# Altium project AMS_Remote_Module.PrjPcb
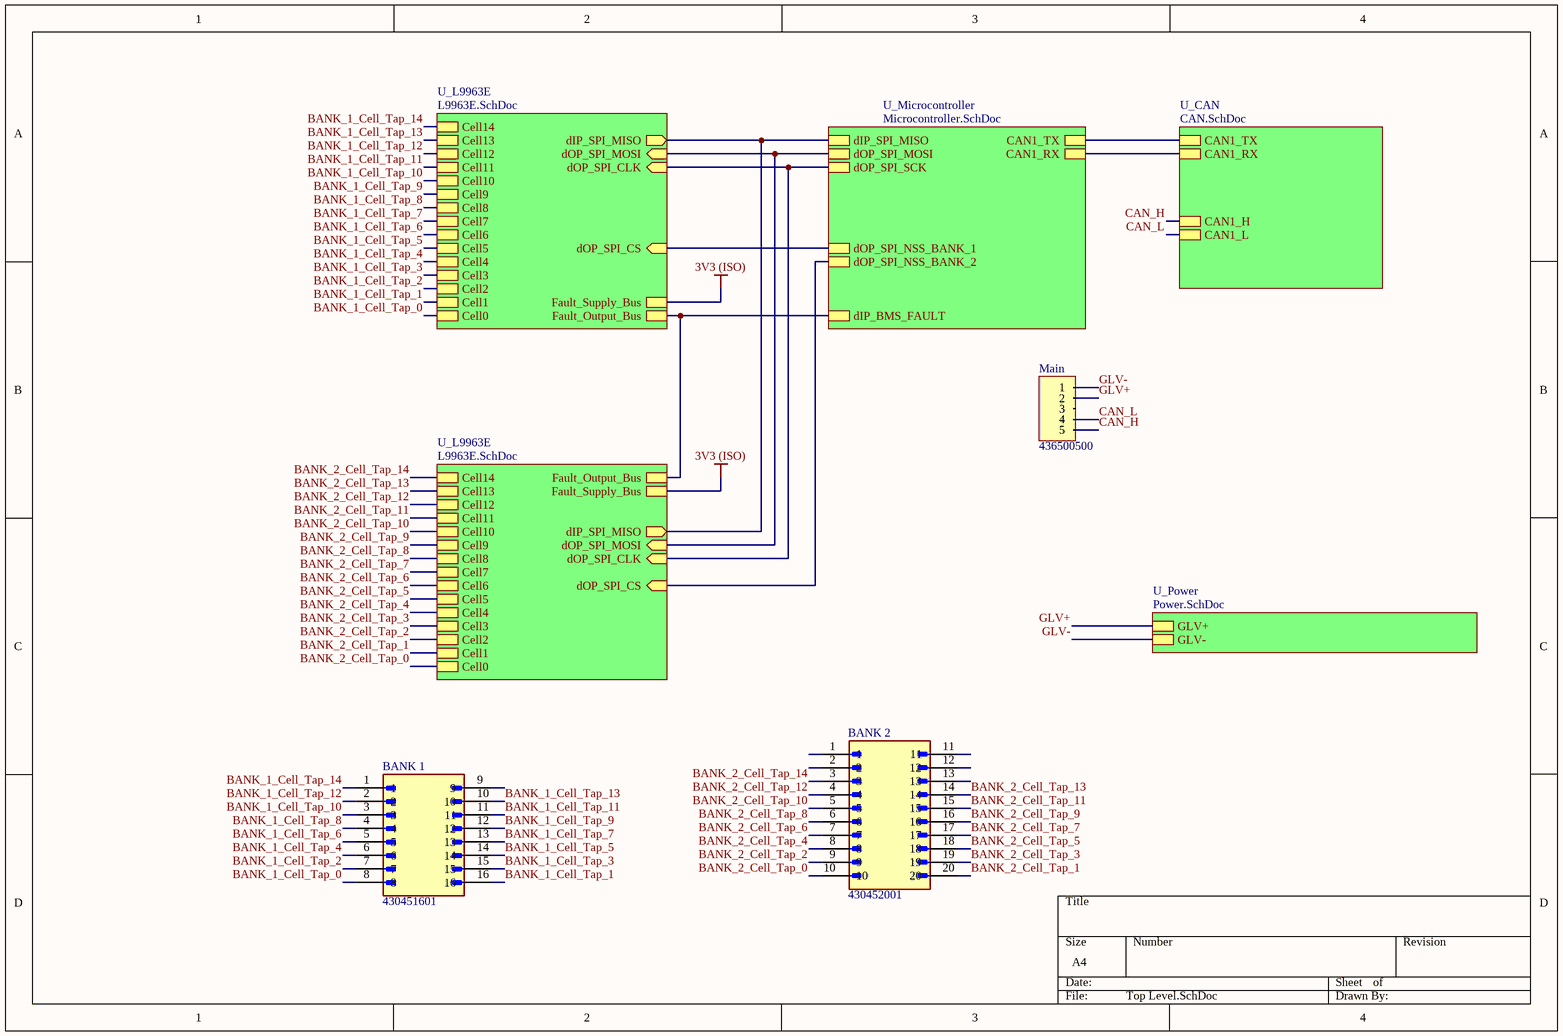
[diagram p0: Top Level.SchDoc]
5 sheets, 282 parts. Net scope: hierarchical (ports join the sheet entries above them; power ports are global).
Board file: AMS_Remote_Module_A1.PcbDoc
Sheets:
  Top Level.SchDoc
    U_Microcontroller = Microcontroller.SchDoc
    U_L9963E = L9963E.SchDoc
    U_CAN = CAN.SchDoc
    U_L9963E = L9963E.SchDoc
    U_Power = Power.SchDoc

## Sheet Top Level.SchDoc
size A4; SheetNumber: 1; SheetTotal: 5

### Parts
BANK_1  430451601  [430451601]
BANK_2  430452001  [430452001]
Main  436500500  [436500500]

### Sub-sheets
U_CAN = CAN.SchDoc: CAN1_H, CAN1_L, CAN1_TX, CAN1_RX
U_L9963E = L9963E.SchDoc: Cell14, Cell13, Cell12, Cell11, Cell10, Cell9, Cell8, Cell7, Cell6, Cell5, Cell4, Cell3, Cell2, Cell1, Cell0, dOP_SPI_CS (in), dOP_SPI_CLK (in), dOP_SPI_MOSI (in), dIP_SPI_MISO (out), Fault_Supply_Bus, Fault_Output_Bus
U_L9963E = L9963E.SchDoc: Cell14, Cell13, Cell12, Cell11, Cell10, Cell9, Cell8, Cell7, Cell6, Cell5, Cell4, Cell3, Cell2, Cell1, Cell0, dOP_SPI_CS (in), dOP_SPI_CLK (in), dOP_SPI_MOSI (in), dIP_SPI_MISO (out), Fault_Supply_Bus, Fault_Output_Bus
U_Microcontroller = Microcontroller.SchDoc: CAN1_RX, CAN1_TX, dIP_SPI_MISO, dOP_SPI_MOSI, dOP_SPI_SCK, dOP_SPI_NSS_BANK_1, dOP_SPI_NSS_BANK_2, dIP_BMS_FAULT
U_Power = Power.SchDoc: GLV+, GLV-

### Nets
3V3 (ISO): sheet U_L9963E/Fault_Supply_Bus, sheet U_L9963E/Fault_Supply_Bus
BANK_1_Cell_Tap_0: BANK_1.8 ; sheet U_L9963E/Cell0
BANK_1_Cell_Tap_1: BANK_1.16 ; sheet U_L9963E/Cell1
BANK_1_Cell_Tap_2: BANK_1.7 ; sheet U_L9963E/Cell2
BANK_1_Cell_Tap_3: BANK_1.15 ; sheet U_L9963E/Cell3
BANK_1_Cell_Tap_4: BANK_1.6 ; sheet U_L9963E/Cell4
BANK_1_Cell_Tap_5: BANK_1.14 ; sheet U_L9963E/Cell5
BANK_1_Cell_Tap_6: BANK_1.5 ; sheet U_L9963E/Cell6
BANK_1_Cell_Tap_7: BANK_1.13 ; sheet U_L9963E/Cell7
BANK_1_Cell_Tap_8: BANK_1.4 ; sheet U_L9963E/Cell8
BANK_1_Cell_Tap_9: BANK_1.12 ; sheet U_L9963E/Cell9
BANK_1_Cell_Tap_10: BANK_1.3 ; sheet U_L9963E/Cell10
BANK_1_Cell_Tap_11: BANK_1.11 ; sheet U_L9963E/Cell11
BANK_1_Cell_Tap_12: BANK_1.2 ; sheet U_L9963E/Cell12
BANK_1_Cell_Tap_13: BANK_1.10 ; sheet U_L9963E/Cell13
BANK_1_Cell_Tap_14: BANK_1.1 ; sheet U_L9963E/Cell14
BANK_2_Cell_Tap_0: BANK_2.10 ; sheet U_L9963E/Cell0
BANK_2_Cell_Tap_1: BANK_2.20 ; sheet U_L9963E/Cell1
BANK_2_Cell_Tap_2: BANK_2.9 ; sheet U_L9963E/Cell2
BANK_2_Cell_Tap_3: BANK_2.19 ; sheet U_L9963E/Cell3
BANK_2_Cell_Tap_4: BANK_2.8 ; sheet U_L9963E/Cell4
BANK_2_Cell_Tap_5: BANK_2.18 ; sheet U_L9963E/Cell5
BANK_2_Cell_Tap_6: BANK_2.7 ; sheet U_L9963E/Cell6
BANK_2_Cell_Tap_7: BANK_2.17 ; sheet U_L9963E/Cell7
BANK_2_Cell_Tap_8: BANK_2.6 ; sheet U_L9963E/Cell8
BANK_2_Cell_Tap_9: BANK_2.16 ; sheet U_L9963E/Cell9
BANK_2_Cell_Tap_10: BANK_2.5 ; sheet U_L9963E/Cell10
BANK_2_Cell_Tap_11: BANK_2.15 ; sheet U_L9963E/Cell11
BANK_2_Cell_Tap_12: BANK_2.4 ; sheet U_L9963E/Cell12
BANK_2_Cell_Tap_13: BANK_2.14 ; sheet U_L9963E/Cell13
BANK_2_Cell_Tap_14: BANK_2.3 ; sheet U_L9963E/Cell14
CAN1_RX: sheet U_Microcontroller/CAN1_RX, sheet U_CAN/CAN1_RX
CAN1_TX: sheet U_Microcontroller/CAN1_TX, sheet U_CAN/CAN1_TX
CAN_H: Main.5 ; sheet U_CAN/CAN1_H
CAN_L: Main.4 ; sheet U_CAN/CAN1_L
GLV+: Main.2 ; sheet U_Power/GLV+
GLV-: Main.1 ; sheet U_Power/GLV-
SPI1_MISO: sheet U_Microcontroller/dIP_SPI_MISO, sheet U_L9963E/dIP_SPI_MISO, sheet U_L9963E/dIP_SPI_MISO
SPI1_MOSI: sheet U_Microcontroller/dOP_SPI_MOSI, sheet U_L9963E/dOP_SPI_MOSI, sheet U_L9963E/dOP_SPI_MOSI
SPI1_NSS_BANK_1: sheet U_Microcontroller/dOP_SPI_NSS_BANK_1, sheet U_L9963E/dOP_SPI_CS
SPI1_NSS_BANK_2: sheet U_Microcontroller/dOP_SPI_NSS_BANK_2, sheet U_L9963E/dOP_SPI_CS
SPI1_SCK: sheet U_Microcontroller/dOP_SPI_SCK, sheet U_L9963E/dOP_SPI_CLK, sheet U_L9963E/dOP_SPI_CLK
NetR3_2: sheet U_Microcontroller/dIP_BMS_FAULT, sheet U_L9963E/Fault_Output_Bus, sheet U_L9963E/Fault_Output_Bus

Not connected (* = marked no-connect by the designer): BANK_1 9; BANK_2 1 2 11 12 13; Main 3

### Library data of the parts
BANK_1 = 430451601: Micro-Fit 8x2 TH R/A; Positions: 16; Pitch: 3.0mm; Angle: 90; Flange: No; Contact: Gold; Price: None; Availability: Unavailable; Package: None; MP: 430451601; Value: *; Part Number: 430451601; Row Spacing: 3.0mm; Digikey Part Number: WM7490-ND; Digikey Link: https://www.digikey.com.au/en/products/detail/molex/0430451601/3044582
BANK_2 = 430452001: Micro-Fit 10x2 TH R/A; Positions: 20; Pitch: 3.0mm; Angle: 90; Flange: No; Contact: Gold; MP: 430452001; Package: None; Price: None; Availability: Unavailable; Value: *; Part Number: 430452001; Row Spacing: 3.0mm; Digikey Part Number: WM7492-ND; Digikey Link: https://www.digikey.com.au/en/products/detail/molex/0430452001/3044584
Main = 436500500: Micro-Fit 5x1; Positions: 5; Pitch: 3.0mm; Angle: 90; Flange: No; Contact: Tin; Part Number: 436500500; Row Spacing: 3.0mm; Digikey Part Number: WM1863-ND; Digikey Link: https://www.digikey.com.au/en/products/detail/molex/0436500500/268992

## Sheet Microcontroller.SchDoc
size A4; SheetNumber: 2; SheetTotal: 5
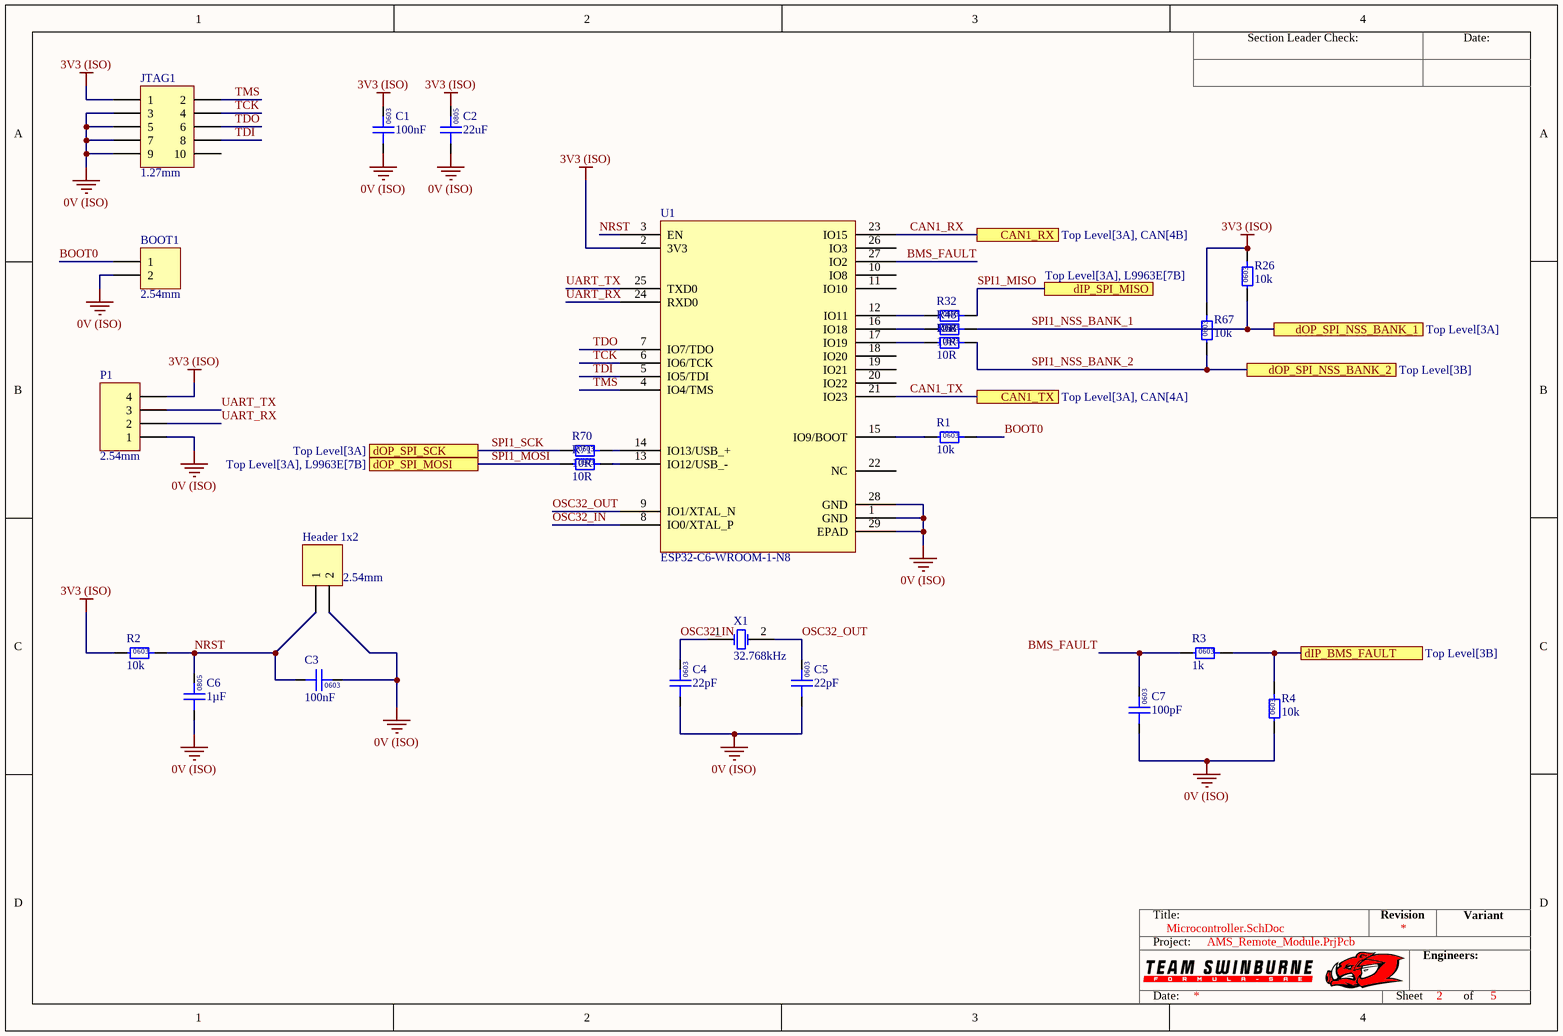
[diagram p1: Microcontroller.SchDoc]

### Parts
BOOT1  2.54mm  [TH 2.54mm Header 1x2]
C1  100nF  [0603]
C2  22uF  [0805]
C3  100nF  [0603]
C4  22pF  [0603]
C5  22pF  [0603]
C6  1µF  [0805]
C7  100pF  [0603]
Header_1x2  2.54mm  [TH 2.54mm Header 1x2]
JTAG1  1.27mm  [3221-10-0300-00]
P1  2.54mm  [TH 2.54mm Header 1x4]
R1  10k  [0603]
R2  10k  [0603]
R3  1k  [0603]
R4  10k  [0603]
R26  10k  [0603]
R32  10R  [0603]
R48  10R  [0603]
R67  10k  [0603]
R68  10R  [0603]
R70  10R  [0603]
R71  10R  [0603]
U1  ESP32-C6-WROOM-1-N8  [ESP32-C6-WROOM-1-N8]
X1  32.768kHz  [EPSON 2-SMD]

### Ports
CAN1_RX (see Top Level[3A], CAN[4B]), CAN1_TX (see Top Level[3A], CAN[4A]), dIP_BMS_FAULT (see Top Level[3B]), dIP_SPI_MISO (see Top Level[3A], L9963E[7B]), dOP_SPI_MOSI (see Top Level[3A], L9963E[7B]), dOP_SPI_NSS_BANK_1 (see Top Level[3A]), dOP_SPI_NSS_BANK_2 (see Top Level[3B]), dOP_SPI_SCK (see Top Level[3A])

### Nets
0V (ISO): BOOT1.2 C1.1 C2.1 C3.2 C4.1 C5.1 C6.1 C7.1 Header_1x2.2 JTAG1.3 JTAG1.5 JTAG1.7 JTAG1.9 P1.1 R4.1 U1.1(GND) U1.28(GND) U1.29(EPAD)
3V3 (ISO): C1.2 C2.2 JTAG1.1 P1.4 R2.1 R26.2 R67.2 U1.2(3V3)
BMS_FAULT: C7.2 R3.1 U1.27(IO2)
BOOT0: BOOT1.1 R1.2
CAN1_RX: U1.23(IO15) ; port CAN1_RX
CAN1_TX: U1.21(IO23) ; port CAN1_TX
NRST: C3.1 C6.2 Header_1x2.1 R2.2 U1.3(EN)
OSC32_IN: C4.2 U1.8(IO0/XTAL_P) X1.1(OSC1)
OSC32_OUT: C5.2 U1.9(IO1/XTAL_N) X1.2(OSC2)
SPI1_MISO: R32.2 ; port dIP_SPI_MISO
SPI1_MOSI: R71.1 ; port dOP_SPI_MOSI
SPI1_NSS_BANK_1: R26.1 R48.2 ; port dOP_SPI_NSS_BANK_1
SPI1_NSS_BANK_2: R67.1 R68.2 ; port dOP_SPI_NSS_BANK_2
SPI1_SCK: R70.1 ; port dOP_SPI_SCK
TCK: JTAG1.4 U1.6(IO6/TCK)
TDI: JTAG1.8 U1.5(IO5/TDI)
TDO: JTAG1.6 U1.7(IO7/TDO)
TMS: JTAG1.2 U1.4(IO4/TMS)
UART_RX: P1.2 U1.24(RXD0)
UART_TX: P1.3 U1.25(TXD0)
NetR1_1: R1.1 U1.15(IO9/BOOT)
NetR3_2: R3.2 R4.2 ; port dIP_BMS_FAULT
NetR32_1: R32.1 U1.12(IO11)
NetR48_1: R48.1 U1.16(IO18)
NetR68_1: R68.1 U1.17(IO19)
NetR70_2: R70.2 U1.14(IO13/USB_+)
NetR71_2: R71.2 U1.13(IO12/USB_-)

Not connected (* = marked no-connect by the designer): JTAG1 10; U1 10(IO8) 11(IO10) 18(IO20) 19(IO21) 20(IO22) 22(NC) 26(IO3)

### Notes on the sheet
- Section Leader Check:
- Date:
- Title:
- Revision
- Variant
- Project:
- Engineers:
- Sheet
- of
- (in symbol GCM21BR71H105KA03L) 0805
- (in symbol GCM188L81H104KA57D) 0603
- (in symbol GRM21BR61A226ME51L) 0805
- (in symbol GRM0335C1H220JA01D) 0603
- (in symbol GRM1885C1H101JA01D) 0603
- (in symbol RC0603FR-071KL) 0603
- (in symbol RC0603FR-0710KL) 0603
- (in symbol RC0603FR-0710RL) 0603

### Library data of the parts
BOOT1 Header_1x2 = TH 2.54mm Header 1x2: Positions: 2; Angle: 0; Flange: No; Contact: NA; Part Number: TH 2.54mm Header 1x2; Pitch: 2.54mm; Row Spacing: 2.54mm
C1 C3 = GCM188L81H104KA57D: Manufacturer: muRata; Rated Voltage: 50V; Tolerance: ±10%; Material: MLCC; Temperature Rating: X8L; Part Number: GCM188L81H104KA57D; Value: 100nF; Digikey Part Number: 490-6049-1-ND
C2 = GRM21BR61A226ME51L: Manufacturer: muRata; Rated Voltage: 50V; Tolerance: 20%; Material: MLCC; Temperature Rating: X5R; Part Number: GRM21BR61A226ME51L; Value: 22uF; Digikey Part Number: 490-10511-1-ND
C4 C5 = GRM0335C1H220JA01D: Manufacturer: Murata Electronics; Rated Voltage: 50V; Tolerance: ±5%; Material: MLCC; Temperature Rating: C0G, NP0; Part Number: GRM0335C1H220JA01D; Value: 22pF; Digikey Part Number: 490-6123-1-ND
C6 = GCM21BR71H105KA03L: Manufacturer: muRata; Rated Voltage: 50V; Tolerance: ±10%; Material: MLCC; Temperature Rating: X7R; Part Number: GCM21BR71H105KA03L; Value: 1µF; Digikey Part Number: 490-10675-1-ND
C7 = GRM1885C1H101JA01D: Manufacturer: Murata Electronics; Rated Voltage: 50V; Tolerance: ±5%; Material: MLCC; Temperature Rating: C0G, NP0; Part Number: GRM1885C1H101JA01D; Value: 100pF; Digikey Part Number: 490-1427-1-ND
JTAG1 = SMD 1.27mm Header 2x5 (3221-10-0300-00): Positions: 10; Angle: 0; Flange: No; Contact: NA; Part Number: SMD 1.27mm Header 2x5 (3221-10-0300-00); Pitch: 1.27mm; Row Spacing: 1.27mm
P1 = TH 2.54mm Header 1x4: Positions: 4; Angle: 0; Flange: No; Contact: NA; Part Number: TH 2.54mm Header 1x4; Pitch: 2.54mm; Row Spacing: 2.54mm
R1 R2 R4 R26 R67 = RC0603FR-0710KL: Manufacturer: YAGEO; Tolerance: 0.01; Rated Power: 0.1W; Part Number: RC0603FR-0710KL; Value: 10k; Material: FR-07; Digikey Part Number: 311-10.0KHRCT-ND
R3 = RC0603FR-071KL: Manufacturer: YAGEO; Tolerance: 0.01; Rated Power: 0.1W; Part Number: RC0603FR-071KL; Value: 1k; Material: FR-07; Digikey Part Number: 311-1.00KHRCT-ND
R32 R48 R68 R70 R71 = RC0603FR-0710RL: Manufacturer: YAGEO; Tolerance: 0.01; Rated Power: 0.1W; Part Number: RC0603FR-0710RL; Value: 10R; Material: FR-07; Digikey Part Number: 311-10.0HRCT-ND
U1 = ESP32-C6-WROOM-1-N8: RF TXRX MOD BT WIFI PCB TH SMD; Manufacturer: Espressif; Complex IC: 1; Part Number: ESP32-C6-WROOM-1-N8
X1 = FC-135 32.7680KA-A5: Manufacturer: EPSON; Load Capacitance: 12.5pF; ESR: 70k; Part Number: FC-135 32.7680KA-A5; Value: 32.768kHz; Digikey Part Number: SER4103TR-ND; Digikey Link: https://www.digikey.com/product-detail/en/epson/FC-135-32.7680KA-A5/SER4103TR-ND/5259895

## Sheet L9963E.SchDoc
size A3; SheetNumber: 3; SheetTotal: 5
Used 2 times, as channels U_L9963E, U_L9963E. Parts and nets are listed once, with the designators drawn on the sheet.
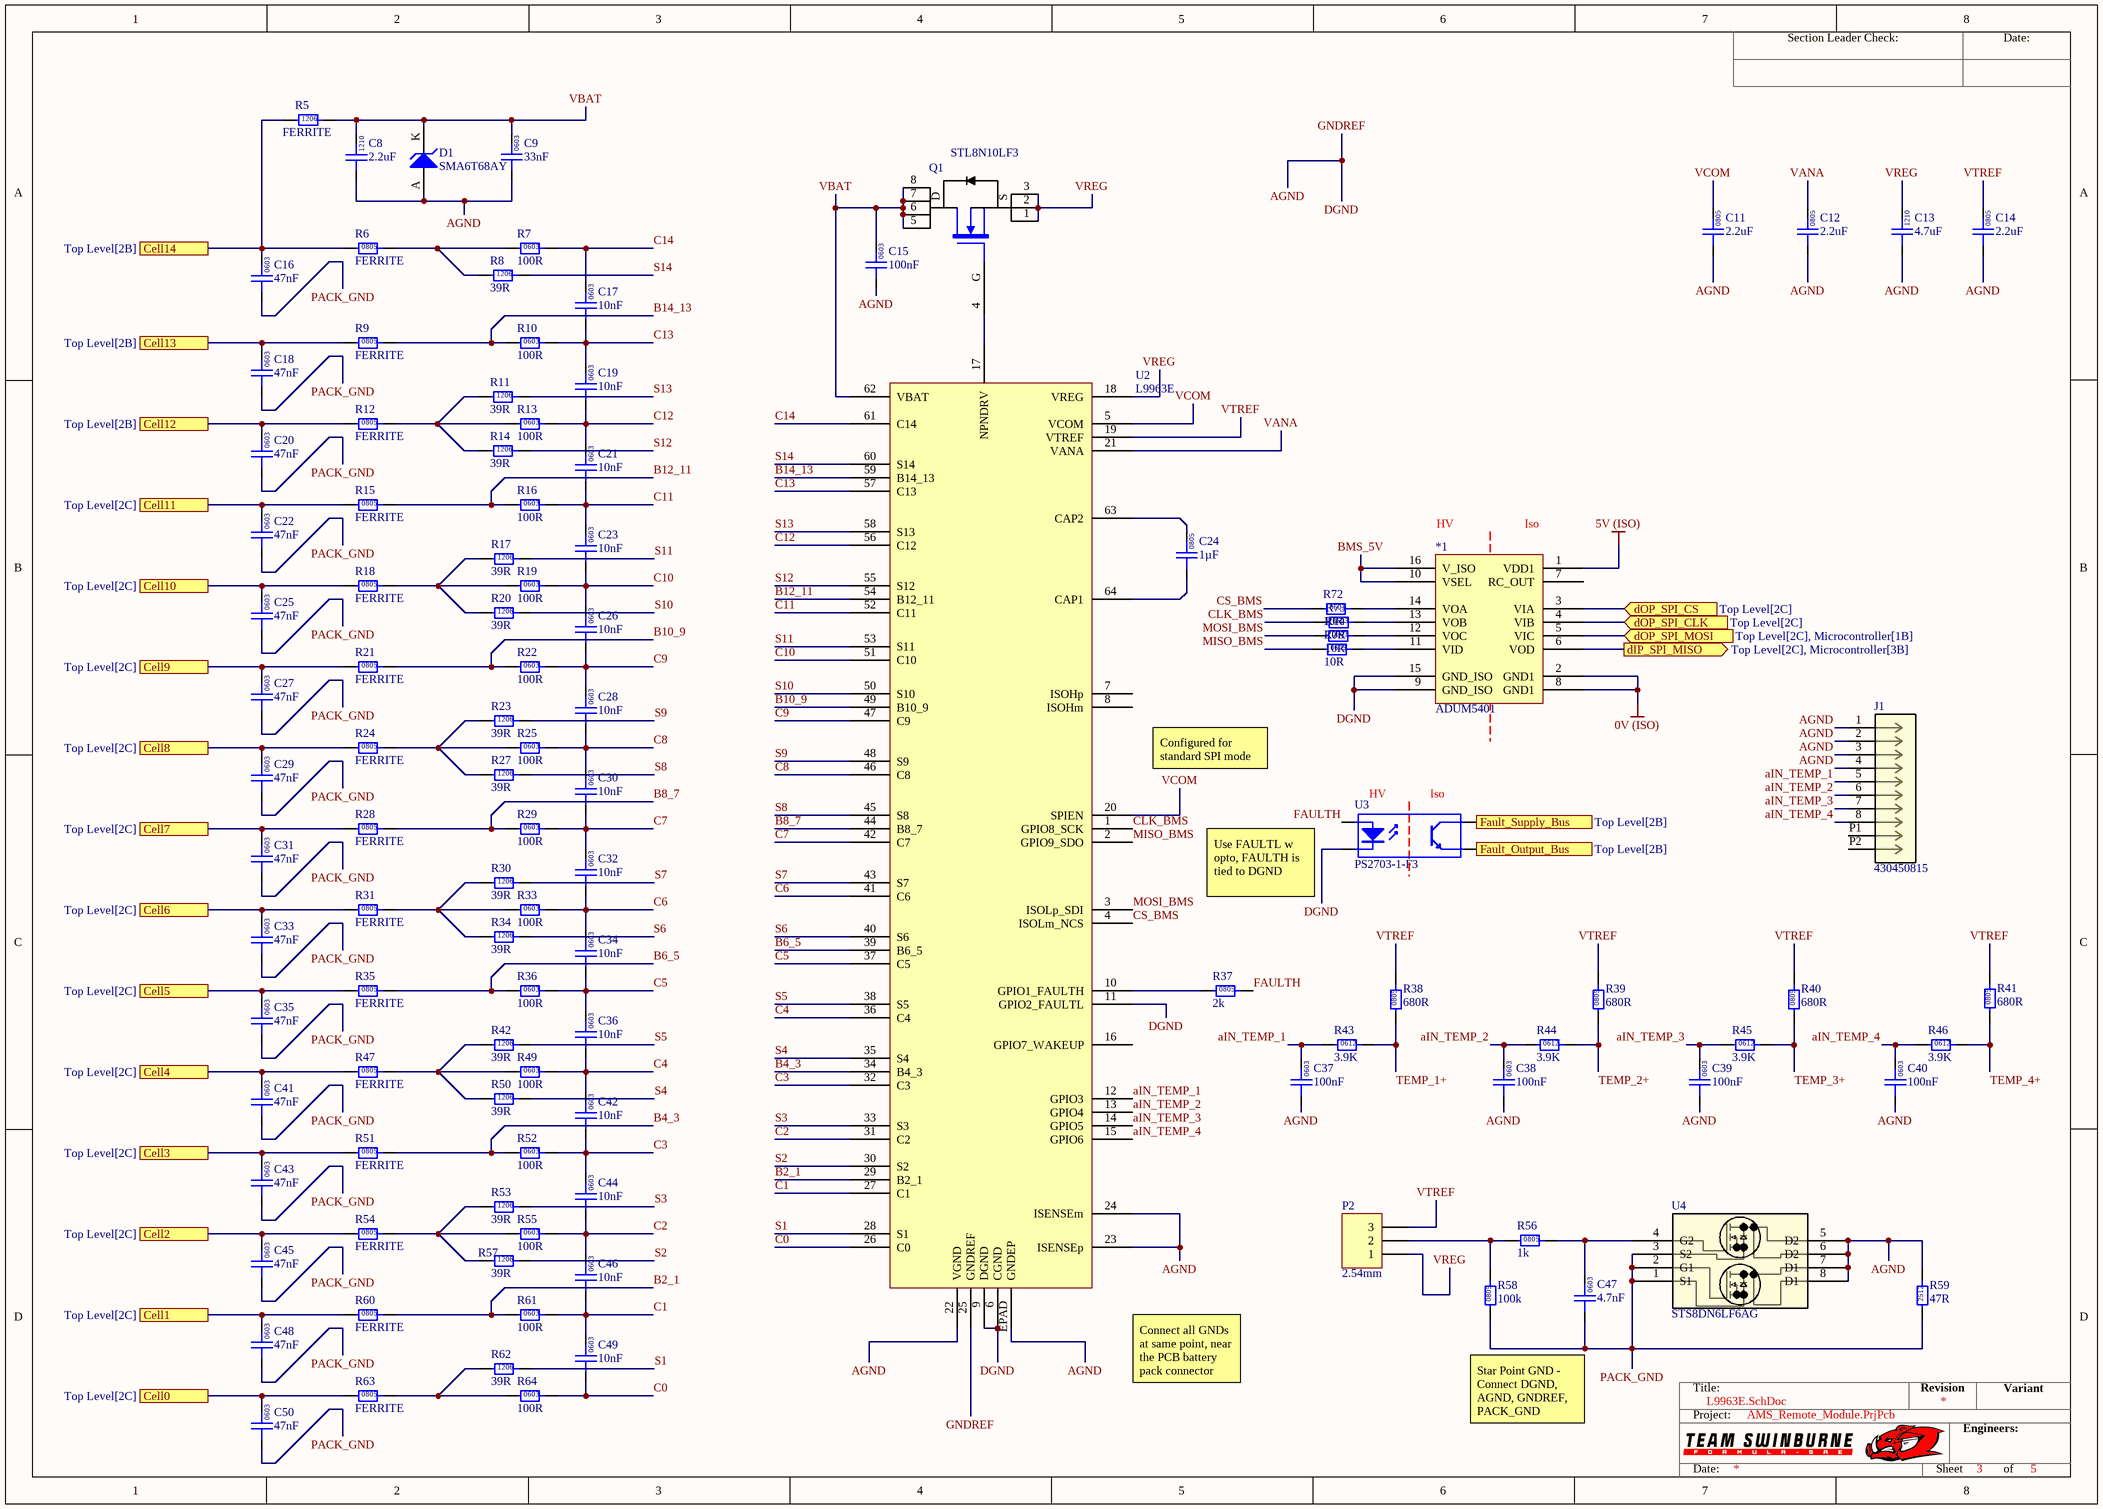
[diagram p2: L9963E.SchDoc]

### Parts
*1  ADUM5401  [AD 16-SOIC]
C8  2.2uF  [1210]
C9  33nF  [0603]
C11  2.2uF  [0805]
C12  2.2uF  [0805]
C13  4.7uF  [1210]
C14  2.2uF  [0805]
C15  100nF  [0603]
C16  47nF  [0603]
C17  10nF  [0603]
C18  47nF  [0603]
C19  10nF  [0603]
C20  47nF  [0603]
C21  10nF  [0603]
C22  47nF  [0603]
C23  10nF  [0603]
C24  1µF  [0805]
C25  47nF  [0603]
C26  10nF  [0603]
C27  47nF  [0603]
C28  10nF  [0603]
C29  47nF  [0603]
C30  10nF  [0603]
C31  47nF  [0603]
C32  10nF  [0603]
C33  47nF  [0603]
C34  10nF  [0603]
C35  47nF  [0603]
C36  10nF  [0603]
C37  100nF  [0603]
C38  100nF  [0603]
C39  100nF  [0603]
C40  100nF  [0603]
C41  47nF  [0603]
C42  10nF  [0603]
C43  47nF  [0603]
C44  10nF  [0603]
C45  47nF  [0603]
C46  10nF  [0603]
C47  4.7nF  [0603]
C48  47nF  [0603]
C49  10nF  [0603]
C50  47nF  [0603]
D1  SMA6T68AY  [ST SMB DIODE]
J1  430450815  [430450815]
P2  2.54mm  [TH 2.54mm Header 1x3]
Q1  STL8N10LF3  [TRANS_STL60P4LLF6]
R5  FERRITE  [1206]
R6  FERRITE  [0805]
R7  100R  [0603]
R8  39R  [1206]
R9  FERRITE  [0805]
R10  100R  [0603]
R11  39R  [1206]
R12  FERRITE  [0805]
R13  100R  [0603]
R14  39R  [1206]
R15  FERRITE  [0805]
R16  100R  [0603]
R17  39R  [1206]
R18  FERRITE  [0805]
R19  100R  [0603]
R20  39R  [1206]
R21  FERRITE  [0805]
R22  100R  [0603]
R23  39R  [1206]
R24  FERRITE  [0805]
R25  100R  [0603]
R27  39R  [1206]
R28  FERRITE  [0805]
R29  100R  [0603]
R30  39R  [1206]
R31  FERRITE  [0805]
R33  100R  [0603]
R34  39R  [1206]
R35  FERRITE  [0805]
R36  100R  [0603]
R37  2k  [0805]
R38  680R  [0805]
R39  680R  [0805]
R40  680R  [0805]
R41  680R  [0805]
R42  39R  [1206]
R43  3.9K  [0612]
R44  3.9K  [0612]
R45  3.9K  [0612]
R46  3.9K  [0612]
R47  FERRITE  [0805]
R49  100R  [0603]
R50  39R  [1206]
R51  FERRITE  [0805]
R52  100R  [0603]
R53  39R  [1206]
R54  FERRITE  [0805]
R55  100R  [0603]
R56  1k  [0805]
R57  39R  [1206]
R58  100k  [0805]
R59  47R  [2512]
R60  FERRITE  [0805]
R61  100R  [0603]
R62  39R  [1206]
R63  FERRITE  [0805]
R64  100R  [0603]
R72  10R  [0603]
R73  10R  [0603]
R74  10R  [0603]
R75  10R  [0603]
U2  L9963E  [TQFP64_L9963E_STM]
U3  PS2703-1-F3  [4-SOP]
U4  STS8DN6LF6AG  [SO-8_STM-M]

### Ports
Cell0 (see Top Level[2C]), Cell1 (see Top Level[2C]), Cell2 (see Top Level[2C]), Cell3 (see Top Level[2C]), Cell4 (see Top Level[2C]), Cell5 (see Top Level[2C]), Cell6 (see Top Level[2C]), Cell7 (see Top Level[2C]), Cell8 (see Top Level[2C]), Cell9 (see Top Level[2C]), Cell10 (see Top Level[2C]), Cell11 (see Top Level[2C]), Cell12 (see Top Level[2B]), Cell13 (see Top Level[2B]), Cell14 (see Top Level[2B]), dIP_SPI_MISO (out, see Top Level[2C], Microcontroller[3B]), dOP_SPI_CLK (in, see Top Level[2C]), dOP_SPI_CS (in, see Top Level[2C]), dOP_SPI_MOSI (in, see Top Level[2C], Microcontroller[1B]), Fault_Output_Bus (see Top Level[2B]), Fault_Supply_Bus (see Top Level[2B])

### Nets
0V (ISO): *1.2(GND1) *1.8(GND1)
5V (ISO): *1.1(VDD1)
AGND: *1.9(GND_ISO) *1.15(GND_ISO) C8.1 C9.1 C11.1 C12.1 C13.1 C14.1 C15.1 C37.1 C38.1 C39.1 C40.1 D1.A J1.1 J1.2 J1.3 J1.4 R59.2 U2.6(CGND) U2.9(DGND) U2.11(GPIO2_FAULTL) U2.22(VGND) U2.23(ISENSEp) U2.24(ISENSEm) U2.25(GNDREF) U2.EPAD(GNDEP) U3.2(K) U4.5(D2) U4.6(D2) U4.7(D1) U4.8(D1)  [also labelled DGND, GNDREF]
aIN_TEMP_1: C37.2 J1.5 R43.1 U2.12(GPIO3)
aIN_TEMP_2: C38.2 J1.6 R44.1 U2.13(GPIO4)
aIN_TEMP_3: C39.2 J1.7 R45.1 U2.14(GPIO5)
aIN_TEMP_4: C40.2 J1.8 R46.1 U2.15(GPIO6)
B2_1: R60.2 R61.1 U2.29(B2_1)
B4_3: R51.2 R52.1 U2.34(B4_3)
B6_5: R35.2 R36.1 U2.39(B6_5)
B8_7: R28.2 R29.1 U2.44(B8_7)
B10_9: R21.2 R22.1 U2.49(B10_9)
B12_11: R15.2 R16.1 U2.54(B12_11)
B14_13: R9.2 R10.1 U2.59(B14_13)
BMS_5V: *1.10(VSEL) *1.16(V_ISO)
C0: C49.1 R64.2 U2.26(C0)
C1: C46.1 C49.2 R61.2 U2.27(C1)
C2: C44.1 C46.2 R55.2 U2.31(C2)
C3: C42.1 C44.2 R52.2 U2.32(C3)
C4: C36.1 C42.2 R49.2 U2.36(C4)
C5: C34.1 C36.2 R36.2 U2.37(C5)
C6: C32.1 C34.2 R33.2 U2.41(C6)
C7: C30.1 C32.2 R29.2 U2.42(C7)
C8: C28.1 C30.2 R25.2 U2.46(C8)
C9: C26.1 C28.2 R22.2 U2.47(C9)
C10: C23.1 C26.2 R19.2 U2.51(C10)
C11: C21.1 C23.2 R16.2 U2.52(C11)
C12: C19.1 C21.2 R13.2 U2.56(C12)
C13: C17.1 C19.2 R10.2 U2.57(C13)
C14: C17.2 R7.2 U2.61(C14)
Cell0: C50.2 R63.1 ; port Cell0
Cell1: C48.2 R60.1 ; port Cell1
Cell2: C45.2 R54.1 ; port Cell2
Cell3: C43.2 R51.1 ; port Cell3
Cell4: C41.2 R47.1 ; port Cell4
Cell5: C35.2 R35.1 ; port Cell5
Cell6: C33.2 R31.1 ; port Cell6
Cell7: C31.2 R28.1 ; port Cell7
Cell8: C29.2 R24.1 ; port Cell8
Cell9: C27.2 R21.1 ; port Cell9
Cell10: C25.2 R18.1 ; port Cell10
Cell11: C22.2 R15.1 ; port Cell11
Cell12: C20.2 R12.1 ; port Cell12
Cell13: C18.2 R9.1 ; port Cell13
Cell14: C16.2 R5.1 R6.1 ; port Cell14
CLK_BMS: R73.1 U2.1(GPIO8_SCK)
CS_BMS: R72.1 U2.4(ISOLm_NCS)
dIP_SPI_MISO: *1.6(VOD) ; port dIP_SPI_MISO
dOP_SPI_CLK: *1.4(VIB) ; port dOP_SPI_CLK
dOP_SPI_CS: *1.3(VIA) ; port dOP_SPI_CS
dOP_SPI_MOSI: *1.5(VIC) ; port dOP_SPI_MOSI
Fault_Output_Bus: U3.3(E) ; port Fault_Output_Bus
Fault_Supply_Bus: U3.4(C) ; port Fault_Supply_Bus
FAULTH: R37.2 U3.1(A)
MISO_BMS: R75.1 U2.2(GPIO9_SDO)
MOSI_BMS: R74.1 U2.3(ISOLp_SDI)
PACK_GND: C16.1 C18.1 C20.1 C22.1 C25.1 C27.1 C29.1 C31.1 C33.1 C35.1 C41.1 C43.1 C45.1 C47.1 C48.1 C50.1 R58.1 R59.1 U4.1(S1) U4.2(G1) U4.3(S2)
S1: R62.2 U2.28(S1)
S2: R57.2 U2.30(S2)
S3: R53.2 U2.33(S3)
S4: R50.2 U2.35(S4)
S5: R42.2 U2.38(S5)
S6: R34.2 U2.40(S6)
S7: R30.2 U2.43(S7)
S8: R27.2 U2.45(S8)
S9: R23.2 U2.48(S9)
S10: R20.2 U2.50(S10)
S11: R17.2 U2.53(S11)
S12: R14.2 U2.55(S12)
S13: R11.2 U2.58(S13)
S14: R8.2 U2.60(S14)
TEMP_1+: R38.1 R43.2
TEMP_2+: R39.1 R44.2
TEMP_3+: R40.1 R45.2
TEMP_4+: R41.1 R46.2
VANA: C12.2 U2.21(VANA)
VBAT: C8.2 C9.2 C15.2 D1.K Q1.5(D) Q1.6(D) Q1.7(D) Q1.8(D) R5.2 U2.62(VBAT)
VCOM: C11.2 U2.5(VCOM) U2.20(SPIEN)
VREG: C13.2 P2.1 Q1.1(S) Q1.2(S) Q1.3(S) U2.18(VREG)
VTREF: C14.2 P2.3 R38.2 R39.2 R40.2 R41.2 U2.19(VTREF)
Net*1_11: *1.11(VID) R75.2
Net*1_12: *1.12(VOC) R74.2
Net*1_13: *1.13(VOB) R73.2
Net*1_14: *1.14(VOA) R72.2
NetC24_1: C24.1 U2.64(CAP1)
NetC24_2: C24.2 U2.63(CAP2)
NetC47_2: C47.2 R56.2 U4.4(G2)
NetP2_2: P2.2 R56.1 R58.2
NetQ1_4: Q1.4(G) U2.17(NPNDRV)
NetR6_2: R6.2 R7.1 R8.1
NetR11_1: R11.1 R12.2 R13.1 R14.1
NetR17_1: R17.1 R18.2 R19.1 R20.1
NetR23_1: R23.1 R24.2 R25.1 R27.1
NetR30_1: R30.1 R31.2 R33.1 R34.1
NetR37_1: R37.1 U2.10(GPIO1_FAULTH)
NetR42_1: R42.1 R47.2 R49.1 R50.1
NetR53_1: R53.1 R54.2 R55.1 R57.1
NetR62_1: R62.1 R63.2 R64.1

Not connected (* = marked no-connect by the designer): *1 7(RC_OUT); J1 P1 P2; U2 7(ISOHp) 8(ISOHm) 16(GPIO7_WAKEUP)

### Channels
U_L9963E: designators end in _U_L9963E#1; ports Cell0=BANK_1_Cell_Tap_0 Cell1=BANK_1_Cell_Tap_1 Cell2=BANK_1_Cell_Tap_2 Cell3=BANK_1_Cell_Tap_3 Cell4=BANK_1_Cell_Tap_4 Cell5=BANK_1_Cell_Tap_5 Cell6=BANK_1_Cell_Tap_6 Cell7=BANK_1_Cell_Tap_7 Cell8=BANK_1_Cell_Tap_8 Cell9=BANK_1_Cell_Tap_9 Cell10=BANK_1_Cell_Tap_10 Cell11=BANK_1_Cell_Tap_11 Cell12=BANK_1_Cell_Tap_12 Cell13=BANK_1_Cell_Tap_13 Cell14=BANK_1_Cell_Tap_14 dIP_SPI_MISO=SPI1_MISO dOP_SPI_CLK=SPI1_SCK dOP_SPI_CS=SPI1_NSS_BANK_1 dOP_SPI_MOSI=SPI1_MOSI Fault_Output_Bus=NetR3_2 Fault_Supply_Bus=3V3 (ISO)
U_L9963E: designators end in _U_L9963E#2; ports Cell0=BANK_2_Cell_Tap_0 Cell1=BANK_2_Cell_Tap_1 Cell2=BANK_2_Cell_Tap_2 Cell3=BANK_2_Cell_Tap_3 Cell4=BANK_2_Cell_Tap_4 Cell5=BANK_2_Cell_Tap_5 Cell6=BANK_2_Cell_Tap_6 Cell7=BANK_2_Cell_Tap_7 Cell8=BANK_2_Cell_Tap_8 Cell9=BANK_2_Cell_Tap_9 Cell10=BANK_2_Cell_Tap_10 Cell11=BANK_2_Cell_Tap_11 Cell12=BANK_2_Cell_Tap_12 Cell13=BANK_2_Cell_Tap_13 Cell14=BANK_2_Cell_Tap_14 dIP_SPI_MISO=SPI1_MISO dOP_SPI_CLK=SPI1_SCK dOP_SPI_CS=SPI1_NSS_BANK_2 dOP_SPI_MOSI=SPI1_MOSI Fault_Output_Bus=NetR3_2 Fault_Supply_Bus=3V3 (ISO)

### Notes on the sheet
- (near *1) HV
- (near *1) Iso
- Configured for standard SPI mode
- (near U3) HV
- (near U3) Iso
- (near U3) Use FAULTL w opto, FAULTH is tied to DGND
- (near U2) Connect all GNDs at same point, near the PCB battery pack connector
- Star Point GND - Connect DGND, AGND, GNDREF, PACK_GND
- Section Leader Check:
- Date:
- Title:
- Revision
- Variant
- Project:
- Engineers:
- Sheet
- of
- (in symbol 3430B2F3K9TDF) 0612
- (in symbol BLM31KN102SH1L) 1206
- (in symbol C1210X475K101T) 1210
- (in symbol CGA3E2X7R2A472K080AA) 0603
- (in symbol CL10B104KC8NNNC) 0603
- (in symbol CL10B333KC8WPNC) 0603
- (in symbol CL32B225KCJSNNE) 1210
- (in symbol CRCW120639R0FKEAHP) 1206
- (in symbol CRCW251247R0FKEG) 2512
- (in symbol GCJ188R92A473KA01D) 0603
- (in symbol GCM21BR71H105KA03L) 0805
- (in symbol GCM188L81H103KA03D) 0603
- (in symbol GRM21BR71E225KE11L) 0805
- (in symbol MPZ2012S102ATD25) 0805
- (in symbol RC0603FR-0710RL) 0603
- (in symbol RC0805FR071KL) 0805
- (in symbol RC0805FR072KL) 0805
- (in symbol RC0805FR07100KL) 0805
- (in symbol RCS0805680RFKEA) 0805

### Library data of the parts
*1 = ADUM5401: Quad Channel 2.5kV Digital Isolator with isoPower; Manufacturer: Analogue Devices; Complex IC: 0; Part Number: ADUM5401
C8 = CL32B225KCJSNNE: Manufacturer: Samsung Electro-Mechanics; Rated Voltage: 100V; Tolerance: ±10%; Material: MLCC; Temperature Rating: X7R; Part Number: CL32B225KCJSNNE; Value: 2.2uF; Digikey Part Number: 1276-3362-6-ND
C9 = CL10B333KC8WPNC: Manufacturer: Samsung Electro-Mechanics; Rated Voltage: 100V; Tolerance: ±10%; Material: MLCC; Temperature Rating: X7R; Part Number: CL10B333KC8WPNC; Value: 33nF; Digikey Part Number: 1276-CL10B333KC8WPNCDKR-ND
C11 C12 C14 = GRM21BR71E225KE11L: Manufacturer: Murata Electronics; Rated Voltage: 25V; Tolerance: ±10%; Material: MLCC; Temperature Rating: X7R; Part Number: GRM21BR71E225KE11L; Value: 2.2uF; Digikey Part Number: 490-14467-2-ND
C13 = C1210X475K101T: Manufacturer: Holy Stone Enterprise Co., Ltd.; Rated Voltage: 100V; Tolerance: ±10%; Material: MLCC; Temperature Rating: X7R; Part Number: C1210X475K101T; Value: 4.7uF; Digikey Part Number: 4587-C1210X475K101TDKR-ND
C15 C37-C40 = CL10B104KC8NNNC: Manufacturer: Samsung Electro-Mechanics; Rated Voltage: 100V; Tolerance: ±10%; Material: MLCC; Temperature Rating: X7R; Part Number: CL10B104KC8NNNC; Value: 100nF; Digikey Part Number: 1276-6807-6-ND
C16 C18 C20 C22 C25 C27 C29 C31 C33 C35 C41 C43 C45 C48 C50 = GCJ188R92A473KA01D: Manufacturer: Murata Electronics; Rated Voltage: 100V; Tolerance: ±10%; Material: MLCC; Temperature Rating: X8R; Part Number: GCJ188R92A473KA01D; Value: 47nF; Digikey Part Number: 490-16473-1-ND
C17 C19 C21 C23 C26 C28 C30 C32 C34 C36 C42 C44 C46 C49 = GCM188L81H103KA03D: Manufacturer: muRata; Rated Voltage: 50V; Tolerance: ±10%; Material: MLCC; Temperature Rating: X8L; Part Number: GCM188L81H103KA03D; Value: 10nF; Digikey Part Number: 490-GCM188L81H103KA03DCT-ND
C24 = GCM21BR71H105KA03L: as C6 on sheet Microcontroller; Part Number: GCM21BR71H105KA03L; Value: 1µF; Digikey Part Number: 490-10675-1-ND
C47 = CGA3E2X7R2A472K080AA: Manufacturer: TDK Corporation; Rated Voltage: 100V; Tolerance: ±10%; Material: MLCC; Temperature Rating: X7R; Part Number: CGA3E2X7R2A472K080AA; Value: 4.7nF; Digikey Part Number: 445-5810-6-ND
D1 = SMA6T68AY: Manufacturer: STMicroelectronics; Breakdown Voltage: 121V; Rated Power: 600W; Part Number: SMA6T68AY
J1 = 430450815: No Description Available; Mfr_Name: Molex Connector Corporation; Positions: 8; Pitch: 3.0mm; Angle: 90; Contact: Gold; RefDes: RefDes; Type: Type; Part Number: 430450815; Row Spacing: 3.0mm; Flange: No; Digikey Part Number: WM7067DKR-ND; Digikey Link: https://www.digikey.com/en/products/detail/molex/0430450815/3044333
P2 = TH 2.54mm Header 1x3: Positions: 3; Angle: 0; Flange: No; Contact: NA; Part Number: TH 2.54mm Header 1x3; Pitch: 2.54mm; Row Spacing: 2.54mm
Q1 = STL8N10LF3: N-Channel 100 V 20A (Tc) 4.3W (Ta), 70W (Tc) Surface Mount PowerFlat™ (5x6); Manufacturer: STMicroelectronics; Published: 24-Mar-1999; LatestRevisionDate: 29-May-2009; LatestRevisionNote: IPC-7351 Footprint Added.; PackageVersion: Sep-2000; PackageReference: SOT-343; Publisher: Altium Limited; PackageDescription: 4-Pin SOT-343 Package 1.3 mm Pitch, 2.1 mm Lead Span; Part Number: STL8N10LF3; Type: N-channel; Rated Power: 70W; Digikey Part Number: 497-13652-6-ND
R5 = BLM31KN102SH1L: Manufacturer: Murata Electronics; Value: 1K; Part Number: BLM31KN102SH1L; Rated Power: Ferrite; Digikey Part Number: 490-16520-6-ND
R6 R9 R12 R15 R18 R21 R24 R28 R31 R35 R47 R51 R54 R60 R63 = MPZ2012S102ATD25: Manufacturer: TDK; Value: 1K; Part Number: MPZ2012S102ATD25; Rated Power: Ferrite
R7 R10 R13 R16 R19 R22 R25 R29 R33 R36 R49 R52 R55 R61 R64 = RC0603FR-0710RL: Manufacturer: YAGEO; Value: 10R; Tolerance: 0.01; Rated Power: 0.1W; Part Number: RC0603FR-0710RL; Material: FR-07; Digikey Part Number: 311-10.0HRCT-ND
R8 R11 R14 R17 R20 R23 R27 R30 R34 R42 R50 R53 R57 R62 = CRCW120639R0FKEAHP: Manufacturer: Vishay Dale; Tolerance: 0.01; Rated Power: 0.75W; Part Number: CRCW120639R0FKEAHP; Value: 39R; Digikey Part Number: 541-39.0UCT-ND
R37 = RC0805FR072KL: Manufacturer: YAGEO; Tolerance: 0.01; Rated Power: 0.125W; Part Number: RC0805FR072KL; Value: 2k; Material: FR-07; Digikey Part Number: 311-2.00KCRCT-ND
R38-R41 = RCS0805680RFKEA: Manufacturer: Vishay Dale; Tolerance: 0.01; Rated Power: 0.5; Part Number: RCS0805680RFKEA; Value: 680R; Material: Thick Film; Digikey Part Number: 541-10548-6-ND
R43-R46 = 3430B2F3K9TDF: Manufacturer: TE Connectivity Passive Product; Tolerance: 0.01; Rated Power: 1.5W; Part Number: 3430B2F3K9TDF; Value: 3.9K; Material: Thick Film; Digikey Part Number: 1712-3430B2F3K9TDFDKR-ND
R56 = RC0805FR071KL: Manufacturer: YAGEO; Tolerance: 0.01; Rated Power: 0.125W; Part Number: RC0805FR071KL; Value: 1k; Material: FR-07; Digikey Part Number: 311-1.00KCRCT-ND
R58 = RC0805FR07100KL: Manufacturer: YAGEO; Tolerance: 0.01; Rated Power: 0.125W; Part Number: RC0805FR07100KL; Value: 100k; Material: FR-07; Digikey Part Number: 311-100KCRCT-ND
R59 = CRCW251247R0FKEG: Manufacturer: Vishay Dale; Tolerance: 0.01; Rated Power: 1W; Part Number: CRCW251247R0FKEG; Value: 47R; Material: Thick Film; Digikey Part Number: 541-47.0AFDKR-ND
R72-R75 = RC0603FR-0710RL: as R32 on sheet Microcontroller; Part Number: RC0603FR-0710RL; Value: 10R; Material: FR-07; Digikey Part Number: 311-10.0HRCT-ND
U2 = L9963E: AUTOMOTIVE CHIP FOR BATTERY MANA; Manufacturer: ST Microelectronics; Complex IC: 1; Part Number: L9963E
U3 = PS2703-1-F3: OPTOISOLATOR 3.75KV TRANS 4SMD; Manufacturer: Renesas Electronics Corporation; Complex IC: 0; Part Number: PS2703-1-F3; Digikey Part Number: 559-1155-6-ND; Digikey Link: https://www.digikey.com.au/en/products/detail/renesas-electronics-corporation/PS2703-1-F3-A/9564816
U4 = STS8DN6LF6AG: Mosfet Array 60V 8A (Ta) 3.2W Surface Mount 8-SO; Mfr_Name: STMicroelectronics; Complex IC: 0; RefDes: RefDes; Type: Type; Part Number: STS8DN6LF6AG; Manufacturer: STMicroelectronics; Digikey Part Number: 497-17309-6-ND; Digikey Link: https://www.digikey.com.au/en/products/detail/stmicro/STS8DN6LF6AG/7360928?utm_adgroup=&utm_source=google&utm_medium=cpc&utm_campaign=PMax%20Shopping_Low%20Performing%20Products&utm_term=&utm_id=go_cmp-20086482685_adg-_ad-__dev-c_ext-_prd-_sig-Cj0KCQjw-5y

## Sheet CAN.SchDoc
size A4; SheetNumber: 4; SheetTotal: 5
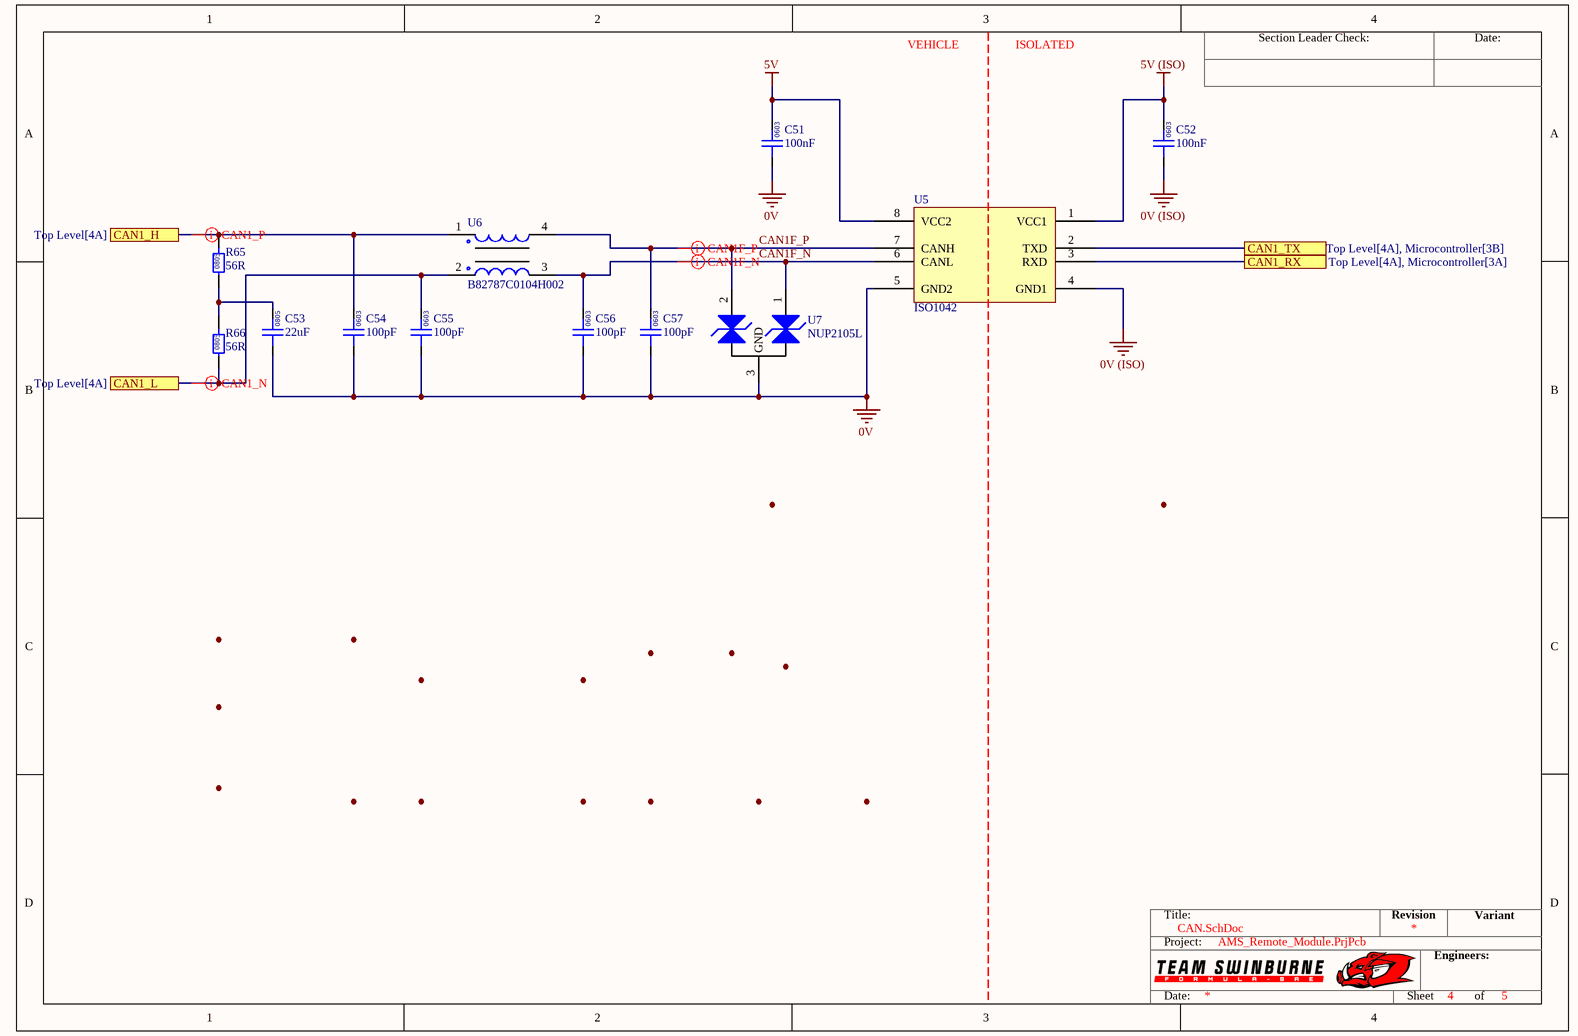
[diagram p3: CAN.SchDoc]

### Parts
C51  100nF  [0603]
C52  100nF  [0603]
C53  22uF  [0805]
C54  100pF  [0603]
C55  100pF  [0603]
C56  100pF  [0603]
C57  100pF  [0603]
R65  56R  [0805]
R66  56R  [0805]
U5  ISO1042  [TI-SOIC-8]
U6  B82787C0104H002  [TDK 4-PC Pad]
U7  NUP2105L  [ON SOT-23]

### Ports
CAN1_H (see Top Level[4A]), CAN1_L (see Top Level[4A]), CAN1_RX (see Top Level[4A], Microcontroller[3A]), CAN1_TX (see Top Level[4A], Microcontroller[3B])

### Nets
0V: C51.1 C53.1 C54.1 C55.1 C56.1 C57.1 U5.5(GND2) U7.3(GND)
0V (ISO): C52.1 U5.4(GND1)
5V: C51.2 U5.8(VCC2)
5V (ISO): C52.2 U5.1(VCC1)
CAN1_RX: U5.3(RXD) ; port CAN1_RX
CAN1_TX: U5.2(TXD) ; port CAN1_TX
CAN1F_N: C56.2 U5.6(CANL) U6.3 U7.1(CAN_H)
CAN1F_P: C57.2 U5.7(CANH) U6.4 U7.2(CAN_L)
CAN_H: C54.2 R65.2 U6.1 ; port CAN1_H
CAN_L: C55.2 R66.1 U6.2 ; port CAN1_L
NetC53_2: C53.2 R65.1 R66.2

### Layout directives
differential pair: CAN1F_N, CAN1F_P, CAN_H, CAN_L

### Notes on the sheet
- VEHICLE
- ISOLATED
- Section Leader Check:
- Date:
- Title:
- Revision
- Variant
- Project:
- Engineers:
- Sheet
- of
- (in symbol GCM188L81H104KA57D) 0603
- (in symbol GRM21BR61A226ME51L) 0805
- (in symbol GRM1885C1H101JA01D) 0603
- (in symbol RC0805FR0756RL) 0805

### Library data of the parts
C51 C52 = GCM188L81H104KA57D: as C1 on sheet Microcontroller; Part Number: GCM188L81H104KA57D; Value: 100nF; Digikey Part Number: 490-6049-1-ND
C53 = GRM21BR61A226ME51L: Manufacturer: muRata; Rated Voltage: 10V; Tolerance: 20%; Material: MLCC; Temperature Rating: X5R; Part Number: GRM21BR61A226ME51L; Value: 22uF; Digikey Part Number: 490-10511-1-ND
C54-C57 = GRM1885C1H101JA01D: as C7 on sheet Microcontroller; Part Number: GRM1885C1H101JA01D; Value: 100pF; Digikey Part Number: 490-1427-1-ND
R65 R66 = RC0805FR0756RL: Manufacturer: YAGEO; Tolerance: 0.01; Rated Power: 0.125W; Part Number: RC0805FR0756RL; Value: 56R; Material: FR-07; Digikey Part Number: 311-56.0CRCT-ND
U5 = ISO1042: IC CAN TRANSCEIVER 1/1 8SOIC; Manufacturer: Texas Instruments; Part Number: ISO1042; Digikey Part Number: 296-ISO1042BQDWVQ1-ND
U6 = B82787C0104H002: Manufacturer: EPCOS (TDK); Value: 100µH @ 100kHz; Impedance: 5.8 kOhms @ 10MHz; Rated Current: 150mA; Part Number: B82787C0104H002; Material: Wirewound; Digikey Part Number: 495-4598-1-ND
U7 = NUP2105L: Dual Line CAN Bus Protector; Manufacturer: ON Semiconductor; Part Number: NUP2105L; Digikey Part Number: NUP2105LT1GOSCT-ND; Digikey Link: https://www.digikey.com/product-detail/en/on-semiconductor/NUP2105LT1G/NUP2105LT1GOSCT-ND/1485001

## Sheet Power.SchDoc
size A3; SheetNumber: 5; SheetTotal: 5
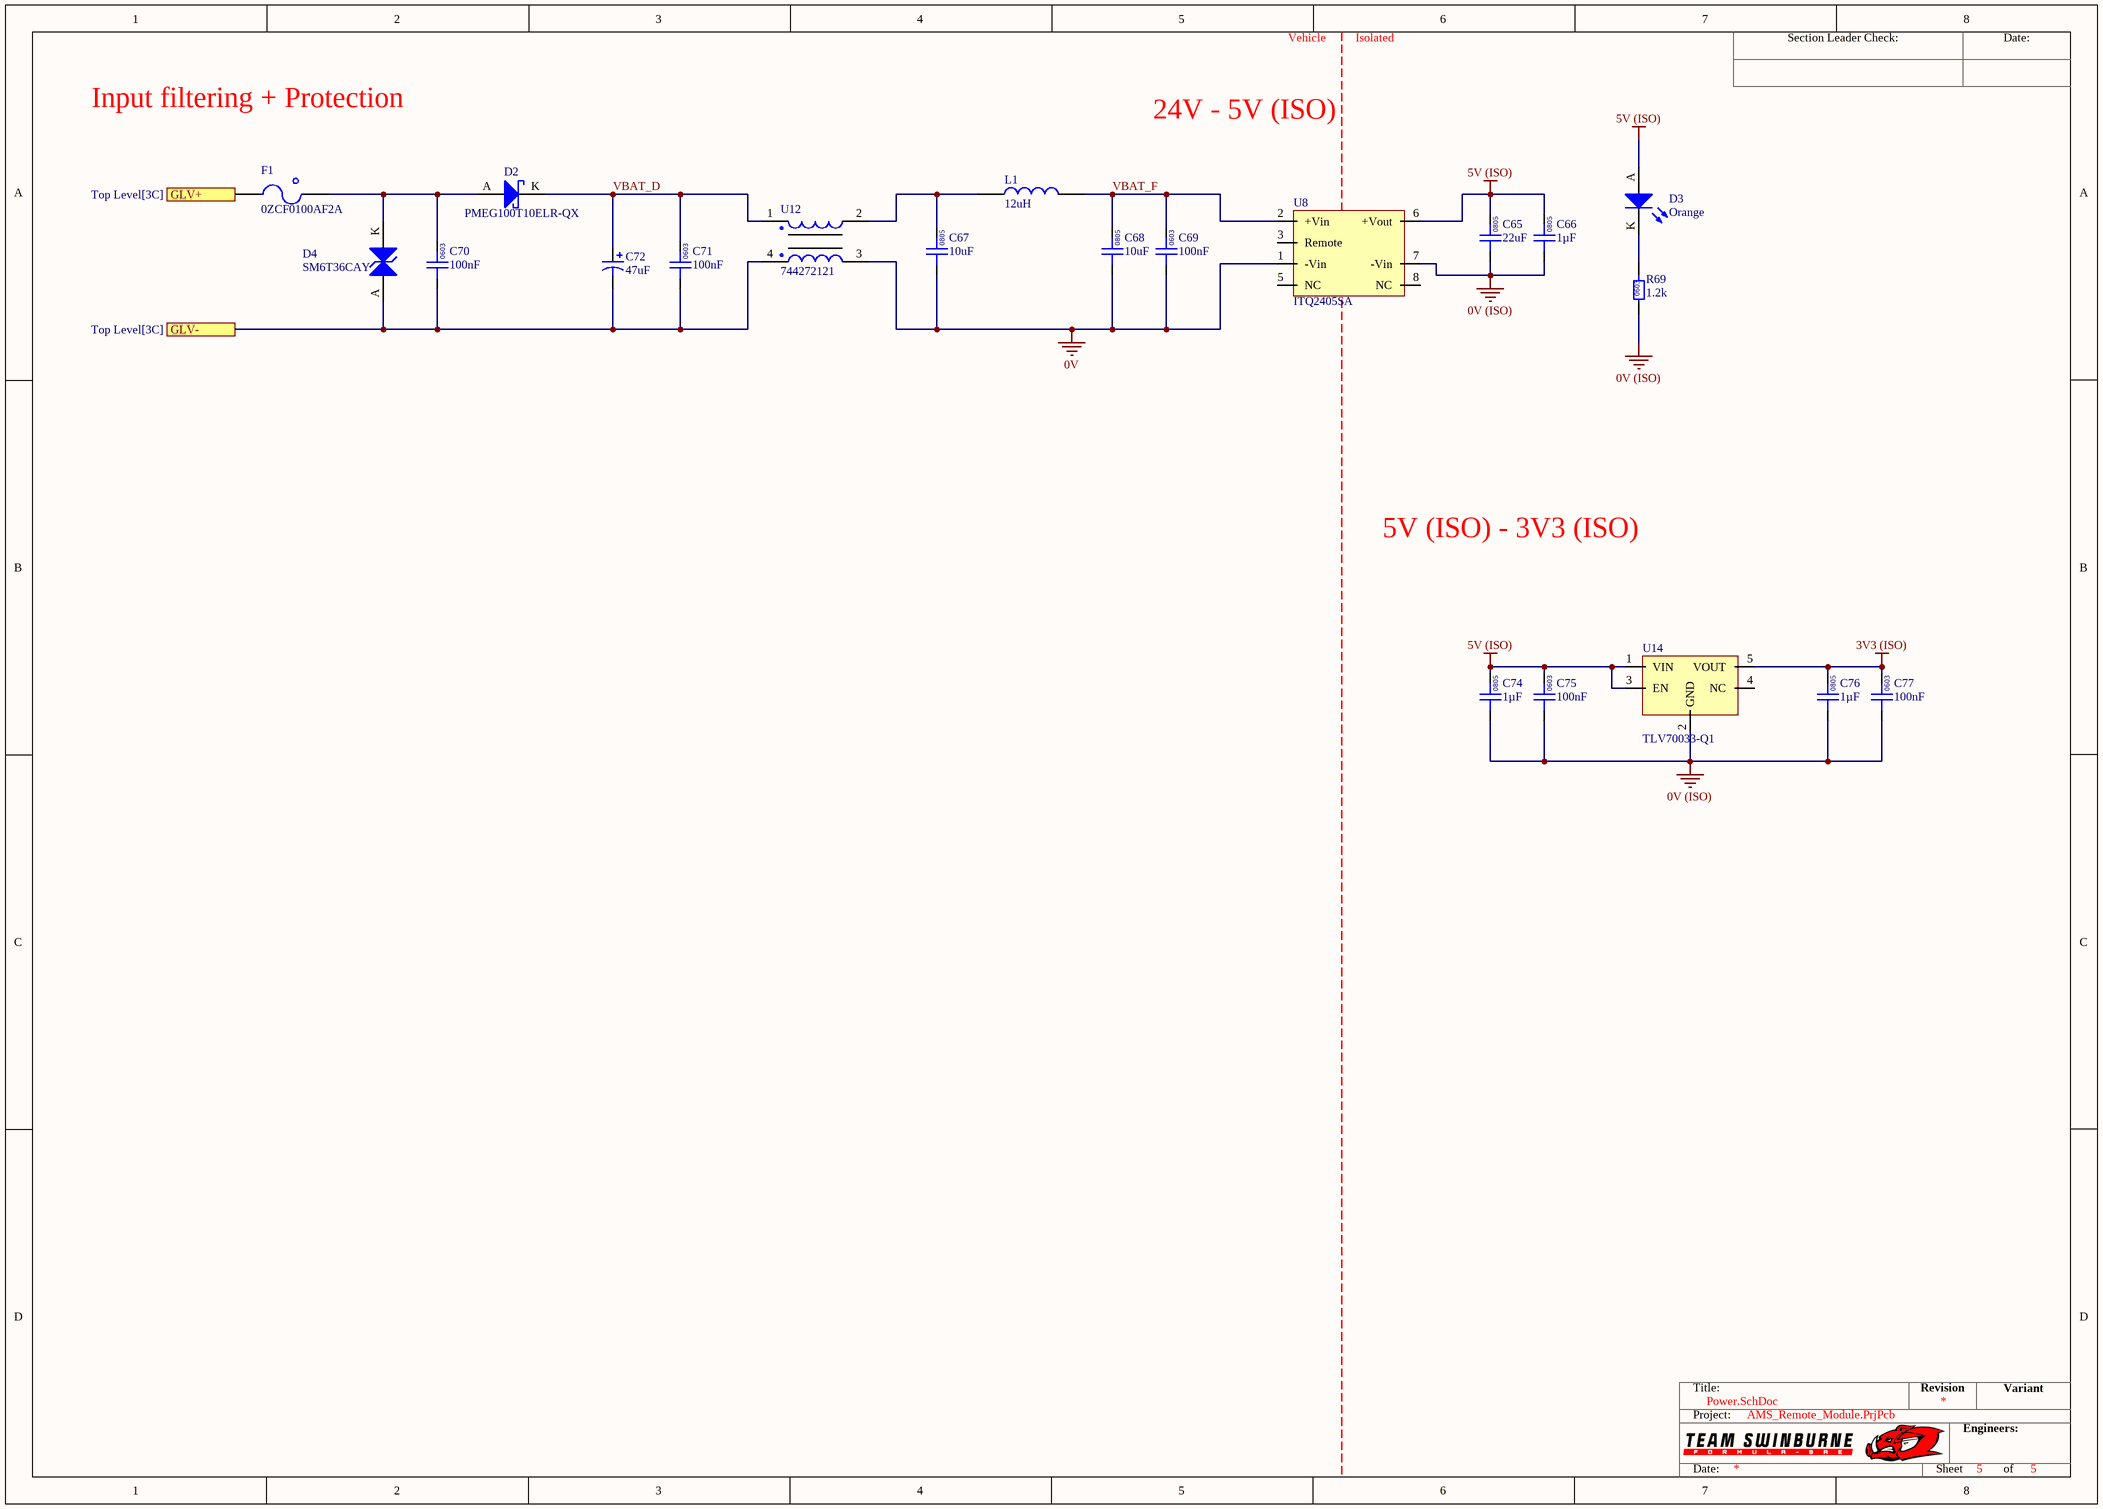
[diagram p4: Power.SchDoc]

### Parts
C65  22uF  [0805]
C66  1µF  [0805]
C67  10uF  [0805]
C68  10uF  [0805]
C69  100nF  [0603]
C70  100nF  [0603]
C71  100nF  [0603]
C72  47uF  [CHEMI-CON ELCO]
C74  1µF  [0805]
C75  100nF  [0603]
C76  1µF  [0805]
C77  100nF  [0603]
D2  PMEG100T10ELR-QX  [NXP SOD123W]
D3  Orange  [0805 LED]
D4  SM6T36CAY  [ST SMB DIODE]
F1  0ZCF0100AF2A  [2920]
L1  12uH  [1812]
R69  1.2k  [0603]
U8  ITQ2405SA  [8-SIP]
U12  744272121  [Wurth 4-PC Pad]
U14  TLV70033-Q1  [TI SOT-23-5]

### Ports
GLV+ (see Top Level[3C]), GLV- (see Top Level[3C])

### Nets
0V: C67.1 C68.1 C69.1 U8.1(-Vin) U12.3
0V (ISO): C65.1 C66.1 C74.1 C75.1 C76.1 C77.1 R69.1 U8.7(-Vin) U14.2(GND)
3V3 (ISO): C76.2 C77.2 U14.5(VOUT)
5V (ISO): C65.2 C66.2 C74.2 C75.2 D3.A U8.6(+Vout) U14.1(VIN) U14.3(EN)
GLV+: F1.1 ; port GLV+
GLV-: C70.1 C71.1 C72.1 D4.A U12.4 ; port GLV-
VBAT_D: C71.2 C72.2 D2.K U12.1
VBAT_F: C68.2 C69.2 L1.1 U8.2(+Vin)
NetC67_2: C67.2 L1.2 U12.2
NetC70_2: C70.2 D2.A D4.K F1.2
NetD3_K: D3.K R69.2

Not connected (* = marked no-connect by the designer): U8 3(Remote) 5(NC) 8(NC); U14 4(NC)

### Notes on the sheet
- Vehicle
- Isolated
- Input filtering + Protection
- 24V - 5V (ISO)
- 5V (ISO) - 3V3 (ISO)
- Section Leader Check:
- Date:
- Title:
- Revision
- Variant
- Project:
- Engineers:
- Sheet
- of
- (in symbol GCM21BR71H105KA03L) 0805
- (in symbol GCM188L81H104KA57D) 0603
- (in symbol GRM21BR6YA106KE43L) 0805
- (in symbol GRM21BR61A226ME51L) 0805
- (in symbol RC0603JR-071K2L) 0603

### Library data of the parts
C65 = GRM21BR61A226ME51L: as C53 on sheet CAN; Part Number: GRM21BR61A226ME51L; Value: 22uF; Digikey Part Number: 490-10511-1-ND
C66 C74 C76 = GCM21BR71H105KA03L: as C6 on sheet Microcontroller; Part Number: GCM21BR71H105KA03L; Value: 1µF; Digikey Part Number: 490-10675-1-ND
C67 C68 = GRM21BR6YA106KE43L: Manufacturer: muRata; Rated Voltage: 50V; Tolerance: 10%; Material: MLCC; Temperature Rating: X5R; Part Number: GRM21BR6YA106KE43L; Value: 10uF; Digikey Part Number: 490-10514-6-ND
C69-C71 C75 C77 = GCM188L81H104KA57D: as C1 on sheet Microcontroller; Part Number: GCM188L81H104KA57D; Value: 100nF; Digikey Part Number: 490-6049-1-ND
C72 = HHXA350ARA470MF61G: Manufacturer: Chemi-Con; Rated Voltage: 35V; Tolerance: 20%; Material: Aluminium Electrolytic; Temperature Rating: 125C; Part Number: HHXA350ARA470MF61G; Value: 47uF
D2 = PMEG100T10ELR-QX: Manufacturer: Nexperia USA Inc.; Forward Voltage: 0.75 V @ 1A; Breakdown Voltage: 100 V; Rated Power: 680 mW; Part Number: PMEG100T10ELR-QX; Digikey Part Number: 1727-PMEG100T10ELR-QXCT-ND
D3 = SML-211DTT86: Orange LED Indication - Discrete 1.75V 0805 (2012 Metric); Manufacturer: ROHM Semiconductor; Part Number: SML-211DTT86; Colour: Orange; Digikey Part Number: 511-1291-1-ND
D4 = SM6T36CAY: Manufacturer: STMicroelectronics; Forward Voltage: 30.8 V; Rated Power: 600W; Part Number: SM6T36CAY; Breakdown Voltage: 30.8 V; Digikey Part Number: 497-10804-1-ND
F1 = 0ZCF0100AF2A: PTC RESET FUSE 60V 1A 292; Manufacturer: Littelfuse Inc.; Part Number: 0ZCF0100AF2A; Digikey Part Number: 507-2070-1-ND; Digikey Link: https://www.digikey.com/product-detail/en/bel-fuse-inc/0ZCF0100AF2A/507-2070-1-ND/6210547
L1 = RLS-126: Manufacturer: Recom; Tolerance: 0.2; Impedance: 230mOhm; Rated Current: 0.8 A; Material: Wirewound; Part Number: RLS-126; Value: 12uH; Digikey Part Number: 945-3429-ND
R69 = RC0603JR-071K2L: Manufacturer: YAGEO; Tolerance: 0.01; Rated Power: 0.1W; Part Number: RC0603JR-071K2L; Value: 1.2k; Material: FR-07; Digikey Part Number: 311-1.2KGRCT-ND
U8 = ITQ2405SA: DC DC CONVERTER 5V 6W; Manufacturer: XP Power; Input Voltage: 9 to 36 V; Output Current: 1.2 A; Part Number: ITQ2405SA; Output Voltage: 5 V; Digikey Part Number: 1470-2858-5-ND
U12 = 744272121: Manufacturer: Wurth Electronics Inc; Value: 120uH @ 100kHz; Impedance: 460 Ohms @ 30MHz; Rated Current: 2.5 A; Part Number: 744272121; Material: Wirewound; Digikey Part Number: 732-1489-1-ND
U14 = TLV70033-Q1: IC REG LINEAR 3.3V 200MA SOT23-5; Manufacturer: Texas Instruments; Input Voltage: 2 to 5.5 V; Output Current: 0.2 A; Part Number: TLV70033-Q1; Output Voltage: 3.3 V; Digikey Part Number: 296-27780-1-ND

## Nets that join several sheets
0V: CAN (8 pins), Power (5 pins)
0V (ISO): Microcontroller (18 pins), U_L9963E (*1_U_L9963E#1.2 *1_U_L9963E#1.8), CAN (C52.1 U5.4), U_L9963E (*1_U_L9963E#2.2 *1_U_L9963E#2.8), Power (9 pins)
3V3 (ISO): Microcontroller (8 pins), U_L9963E (U3_U_L9963E#1.4), U_L9963E (U3_U_L9963E#2.4), Power (C76.2 C77.2 U14.5)
5V (ISO): U_L9963E (*1_U_L9963E#1.1), CAN (C52.2 U5.1), U_L9963E (*1_U_L9963E#2.1), Power (8 pins)
BANK_1_Cell_Tap_0: Top Level (BANK_1.8), U_L9963E (C50_U_L9963E#1.2 R63_U_L9963E#1.1)
BANK_1_Cell_Tap_1: Top Level (BANK_1.16), U_L9963E (C48_U_L9963E#1.2 R60_U_L9963E#1.1)
BANK_1_Cell_Tap_2: Top Level (BANK_1.7), U_L9963E (C45_U_L9963E#1.2 R54_U_L9963E#1.1)
BANK_1_Cell_Tap_3: Top Level (BANK_1.15), U_L9963E (C43_U_L9963E#1.2 R51_U_L9963E#1.1)
BANK_1_Cell_Tap_4: Top Level (BANK_1.6), U_L9963E (C41_U_L9963E#1.2 R47_U_L9963E#1.1)
BANK_1_Cell_Tap_5: Top Level (BANK_1.14), U_L9963E (C35_U_L9963E#1.2 R35_U_L9963E#1.1)
BANK_1_Cell_Tap_6: Top Level (BANK_1.5), U_L9963E (C33_U_L9963E#1.2 R31_U_L9963E#1.1)
BANK_1_Cell_Tap_7: Top Level (BANK_1.13), U_L9963E (C31_U_L9963E#1.2 R28_U_L9963E#1.1)
BANK_1_Cell_Tap_8: Top Level (BANK_1.4), U_L9963E (C29_U_L9963E#1.2 R24_U_L9963E#1.1)
BANK_1_Cell_Tap_9: Top Level (BANK_1.12), U_L9963E (C27_U_L9963E#1.2 R21_U_L9963E#1.1)
BANK_1_Cell_Tap_10: Top Level (BANK_1.3), U_L9963E (C25_U_L9963E#1.2 R18_U_L9963E#1.1)
BANK_1_Cell_Tap_11: Top Level (BANK_1.11), U_L9963E (C22_U_L9963E#1.2 R15_U_L9963E#1.1)
BANK_1_Cell_Tap_12: Top Level (BANK_1.2), U_L9963E (C20_U_L9963E#1.2 R12_U_L9963E#1.1)
BANK_1_Cell_Tap_13: Top Level (BANK_1.10), U_L9963E (C18_U_L9963E#1.2 R9_U_L9963E#1.1)
BANK_1_Cell_Tap_14: Top Level (BANK_1.1), U_L9963E (C16_U_L9963E#1.2 R5_U_L9963E#1.1 R6_U_L9963E#1.1)
BANK_2_Cell_Tap_0: Top Level (BANK_2.10), U_L9963E (C50_U_L9963E#2.2 R63_U_L9963E#2.1)
BANK_2_Cell_Tap_1: Top Level (BANK_2.20), U_L9963E (C48_U_L9963E#2.2 R60_U_L9963E#2.1)
BANK_2_Cell_Tap_2: Top Level (BANK_2.9), U_L9963E (C45_U_L9963E#2.2 R54_U_L9963E#2.1)
BANK_2_Cell_Tap_3: Top Level (BANK_2.19), U_L9963E (C43_U_L9963E#2.2 R51_U_L9963E#2.1)
BANK_2_Cell_Tap_4: Top Level (BANK_2.8), U_L9963E (C41_U_L9963E#2.2 R47_U_L9963E#2.1)
BANK_2_Cell_Tap_5: Top Level (BANK_2.18), U_L9963E (C35_U_L9963E#2.2 R35_U_L9963E#2.1)
BANK_2_Cell_Tap_6: Top Level (BANK_2.7), U_L9963E (C33_U_L9963E#2.2 R31_U_L9963E#2.1)
BANK_2_Cell_Tap_7: Top Level (BANK_2.17), U_L9963E (C31_U_L9963E#2.2 R28_U_L9963E#2.1)
BANK_2_Cell_Tap_8: Top Level (BANK_2.6), U_L9963E (C29_U_L9963E#2.2 R24_U_L9963E#2.1)
BANK_2_Cell_Tap_9: Top Level (BANK_2.16), U_L9963E (C27_U_L9963E#2.2 R21_U_L9963E#2.1)
BANK_2_Cell_Tap_10: Top Level (BANK_2.5), U_L9963E (C25_U_L9963E#2.2 R18_U_L9963E#2.1)
BANK_2_Cell_Tap_11: Top Level (BANK_2.15), U_L9963E (C22_U_L9963E#2.2 R15_U_L9963E#2.1)
BANK_2_Cell_Tap_12: Top Level (BANK_2.4), U_L9963E (C20_U_L9963E#2.2 R12_U_L9963E#2.1)
BANK_2_Cell_Tap_13: Top Level (BANK_2.14), U_L9963E (C18_U_L9963E#2.2 R9_U_L9963E#2.1)
BANK_2_Cell_Tap_14: Top Level (BANK_2.3), U_L9963E (C16_U_L9963E#2.2 R5_U_L9963E#2.1 R6_U_L9963E#2.1)
CAN1_RX: Microcontroller (U1.23), CAN (U5.3)
CAN1_TX: Microcontroller (U1.21), CAN (U5.2)
CAN_H: Top Level (Main.5), CAN (C54.2 R65.2 U6.1)
CAN_L: Top Level (Main.4), CAN (C55.2 R66.1 U6.2)
GLV+: Top Level (Main.2), Power (F1.1)
GLV-: Top Level (Main.1), Power (5 pins)
NetR3_2: Microcontroller (R3.2 R4.2), U_L9963E (U3_U_L9963E#1.3), U_L9963E (U3_U_L9963E#2.3)
SPI1_MISO: Microcontroller (R32.2), U_L9963E (*1_U_L9963E#1.6), U_L9963E (*1_U_L9963E#2.6)
SPI1_MOSI: Microcontroller (R71.1), U_L9963E (*1_U_L9963E#1.5), U_L9963E (*1_U_L9963E#2.5)
SPI1_NSS_BANK_1: Microcontroller (R26.1 R48.2), U_L9963E (*1_U_L9963E#1.3)
SPI1_NSS_BANK_2: Microcontroller (R67.1 R68.2), U_L9963E (*1_U_L9963E#2.3)
SPI1_SCK: Microcontroller (R70.1), U_L9963E (*1_U_L9963E#1.4), U_L9963E (*1_U_L9963E#2.4)